# Altium schematic sheet 核心控制板原理图.SchDoc
size A4
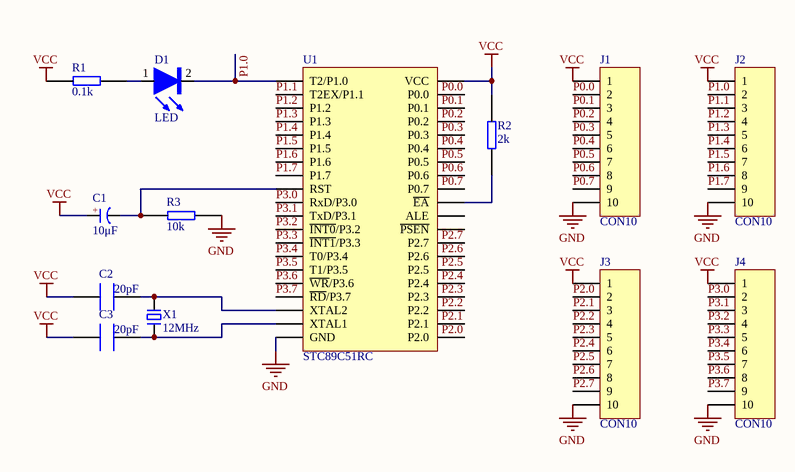
[diagram p0: 核心控制板原理图.SchDoc]

## Parts
C1  10μF
C2  20pF  [0805C]
C3  20pF  [0805C]
D1  LED  [0805D]
J1  CON10
J2  CON10
J3  CON10
J4  CON10
R1  0.1k  [0805R]
R2  2k  [0805R]
R3  10k  [0805R]
U1  STC89C51RC  [DIP40-600]
X1  12MHz  [OSC HC-49S]

## Nets
GND: J1.10 J2.10 J3.10 J4.10 R3.1 U1.20(GND)
VCC: C1.1(A) C2.2 C3.1 J1.1 J2.1 J3.1 J4.1 R1.2 R2.2 U1.40(VCC)
P0.0: J1.2 U1.39(P0.0)
P0.1: J1.3 U1.38(P0.1)
P0.2: J1.4 U1.37(P0.2)
P0.3: J1.5 U1.36(P0.3)
P0.4: J1.6 U1.35(P0.4)
P0.5: J1.7 U1.34(P0.5)
P0.6: J1.8 U1.33(P0.6)
P0.7: J1.9 U1.32(P0.7)
P1.0: D1.2 J2.2 U1.1(T2/P1.0)
P1.1: J2.3 U1.2(T2EX/P1.1)
P1.2: J2.4 U1.3(P1.2)
P1.3: J2.5 U1.4(P1.3)
P1.4: J2.6 U1.5(P1.4)
P1.5: J2.7 U1.6(P1.5)
P1.6: J2.8 U1.7(P1.6)
P1.7: J2.9 U1.8(P1.7)
P2.0: J3.2 U1.21(P2.0)
P2.1: J3.3 U1.22(P2.1)
P2.2: J3.4 U1.23(P2.2)
P2.3: J3.5 U1.24(P2.3)
P2.4: J3.6 U1.25(P2.4)
P2.5: J3.7 U1.26(P2.5)
P2.6: J3.8 U1.27(P2.6)
P2.7: J3.9 U1.28(P2.7)
P3.0: J4.2 U1.10(RxD/P3.0)
P3.1: J4.3 U1.11(TxD/P3.1)
P3.2: J4.4 U1.12(~{INT0}/P3.2)
P3.3: J4.5 U1.13(~{INT1}/P3.3)
P3.4: J4.6 U1.14(T0/P3.4)
P3.5: J4.7 U1.15(T1/P3.5)
P3.6: J4.8 U1.16(~{WR}/P3.6)
P3.7: J4.9 U1.17(~{RD}/P3.7)
NetC1_2: C1.2(K) R3.2 U1.9(RST)
NetC2_1: C2.1 U1.18(XTAL2) X1.1
NetC3_2: C3.2 U1.19(XTAL1) X1.2
NetD1_1: D1.1 R1.1
NetR2_1: R2.1 U1.31(~{EA})

Not connected (* = marked no-connect by the designer): U1 29(~{PSEN}) 30(ALE)

## Notes on the sheet
- (in symbol 极性电容) +

## Library data of the parts
C1 = 极性电容
C2 C3 = CAP: 电容
J1-J4 = CON10: Connector
R1-R3 = RES: 电阻
U1 = STC89C51RC: STC单片机; 版权归属: 源创客; BOM名称: STC单片机; 学习资源: www.ooocke.com
X1 = XTAL-2P: 2脚无源脚晶振; 版权归属: 源创客; BOM名称: 2脚无源脚晶振; 学习资源: www.ooocke.com